# Altium schematic sheet DNJLV1.1.SchDoc
size A2; SheetNumber: 2; SheetTotal: 3
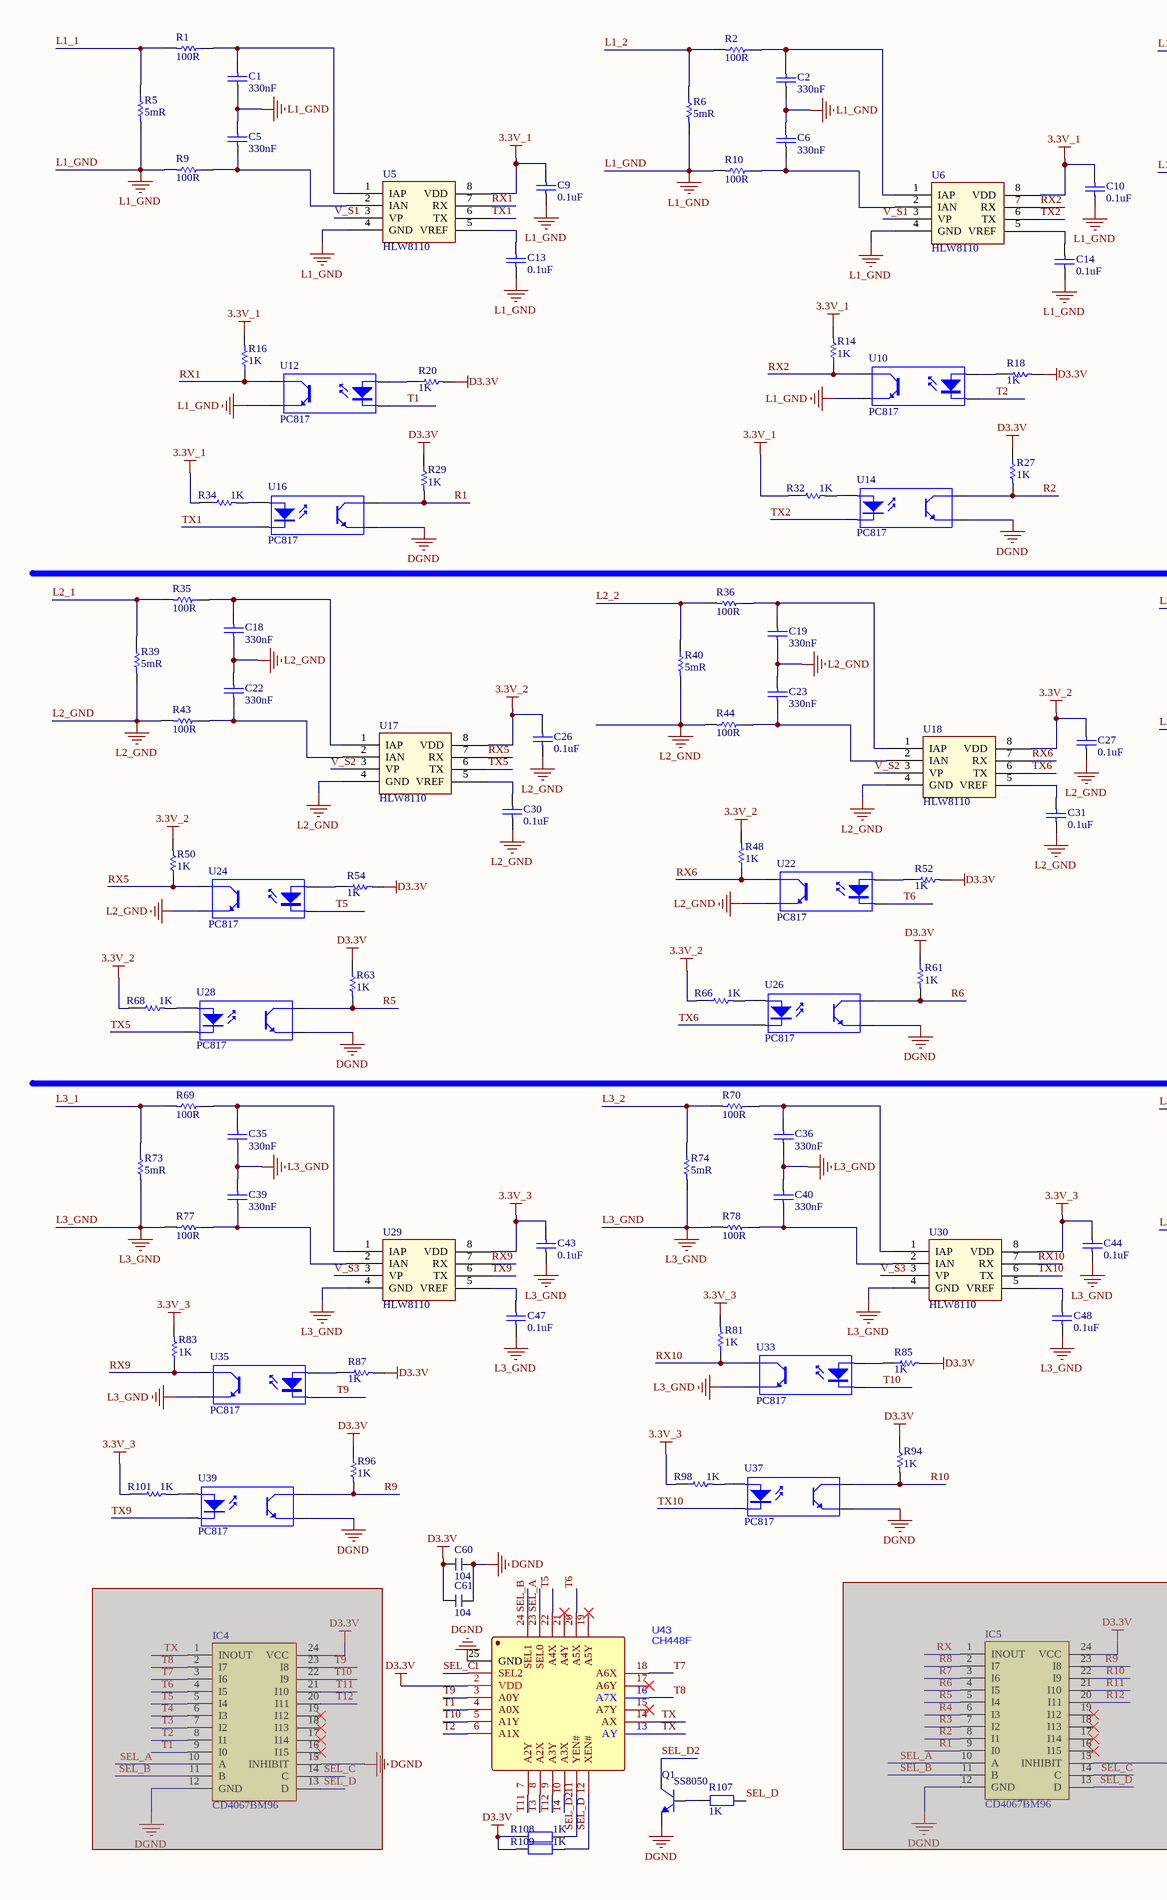
[diagram p0: DNJLV1.1.SchDoc, left]
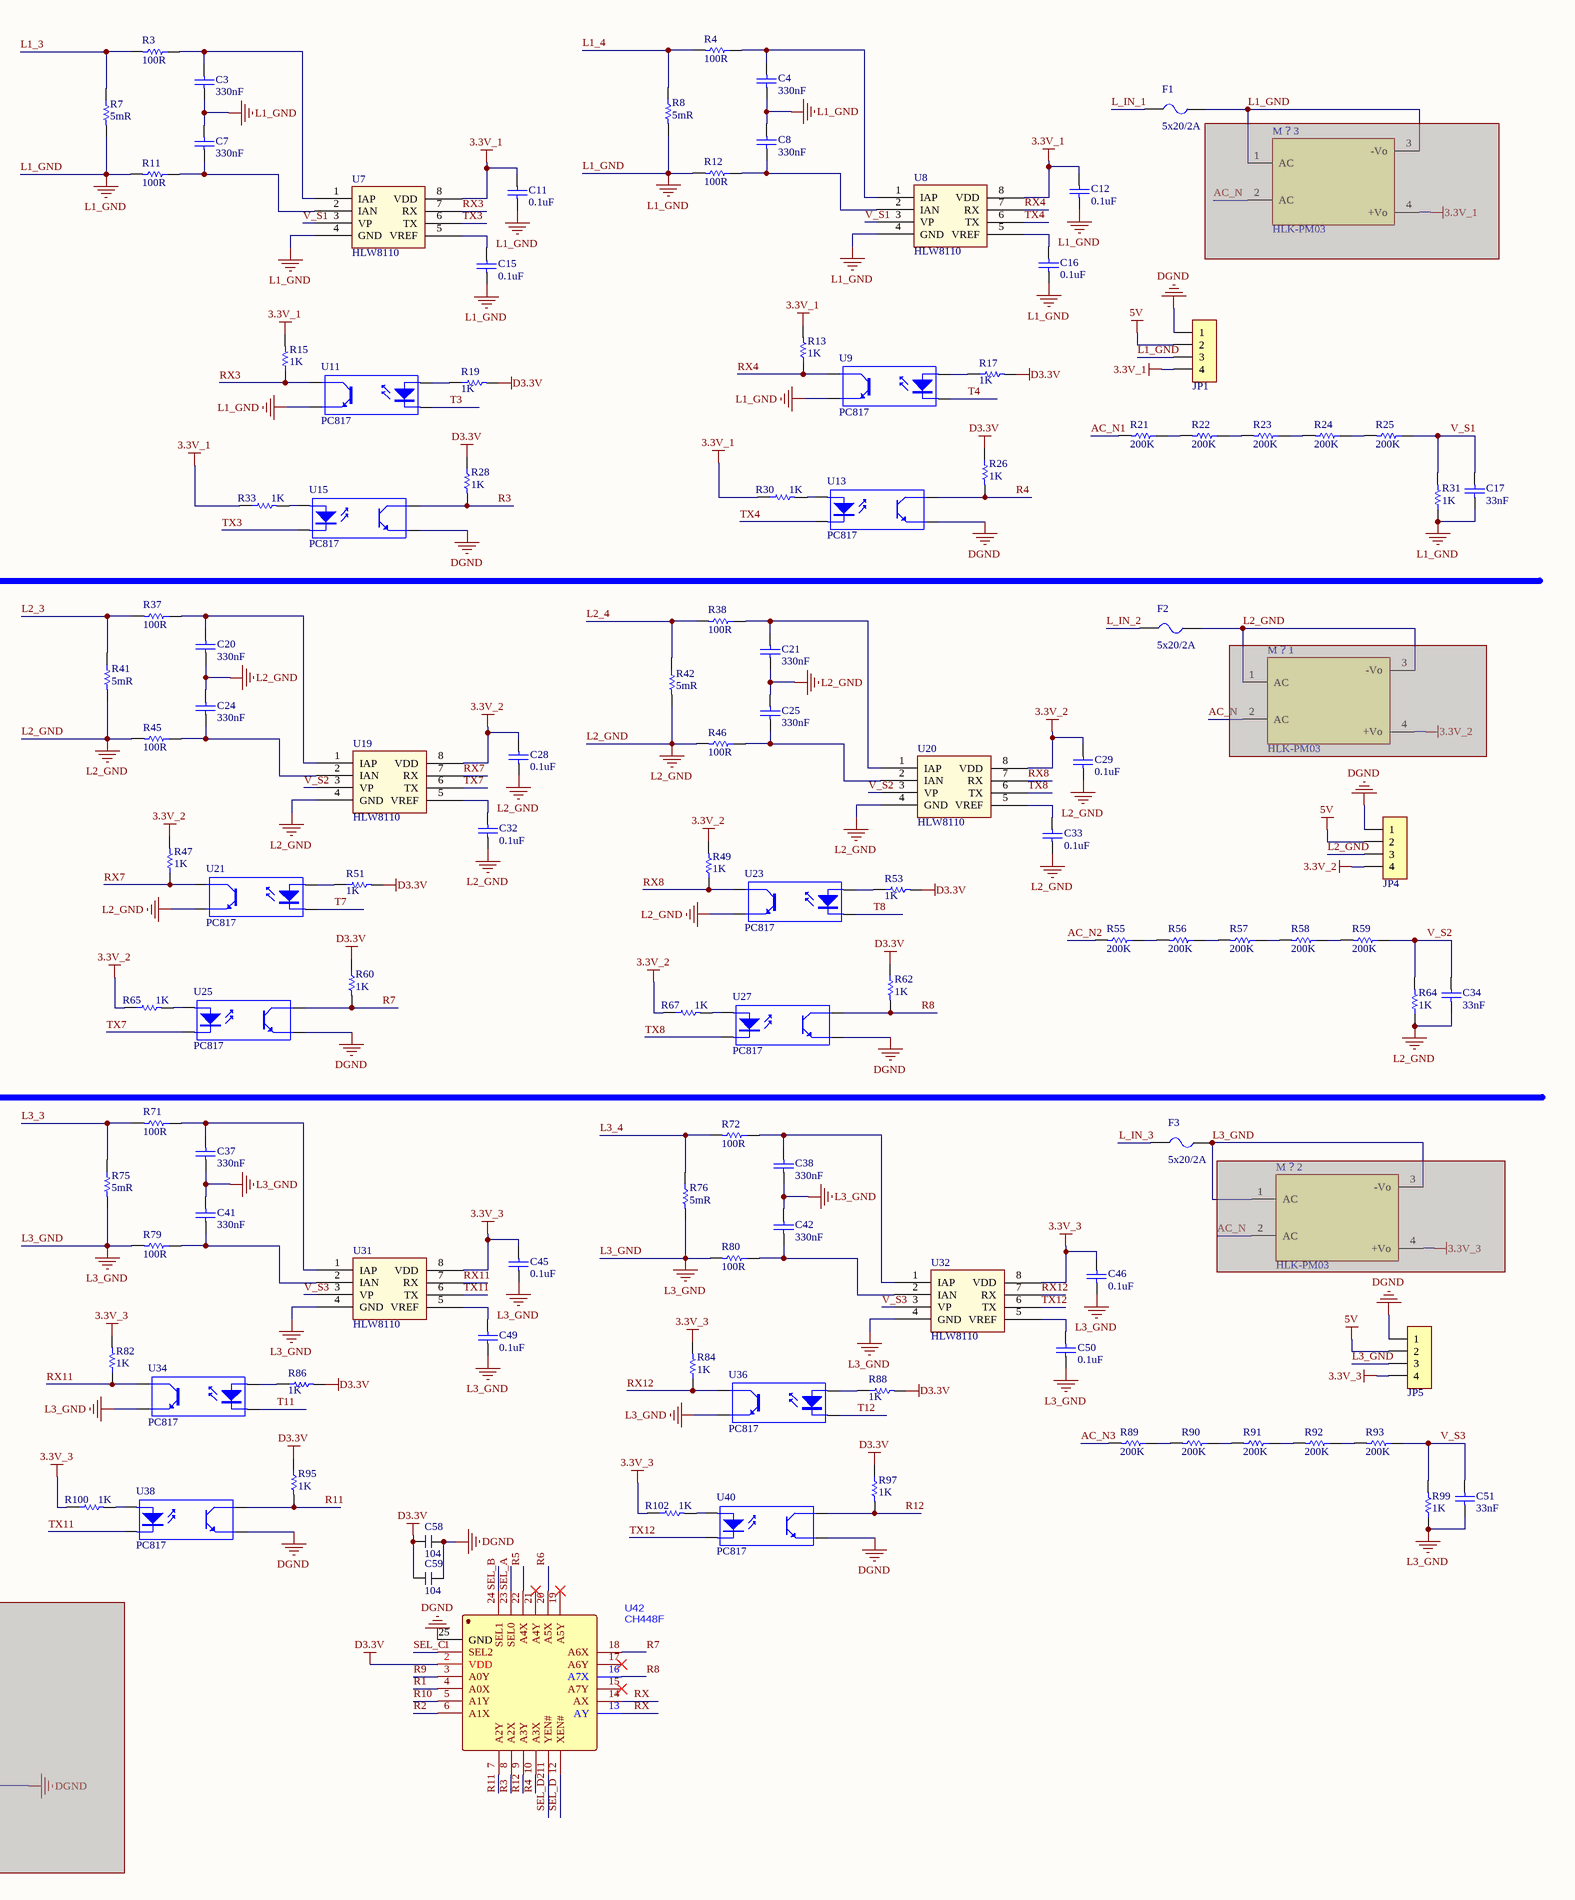
[diagram p1: DNJLV1.1.SchDoc, right]

## Parts
C1  330nF  [C 0805_L]
C2  330nF  [C 0805_L]
C3  330nF  [C 0805_L]
C4  330nF  [C 0805_L]
C5  330nF  [C 0805_L]
C6  330nF  [C 0805_L]
C7  330nF  [C 0805_L]
C8  330nF  [C 0805_L]
C9  0.1uF  [C 0805_L]
C10  0.1uF  [C 0805_L]
C11  0.1uF  [C 0805_L]
C12  0.1uF  [C 0805_L]
C13  0.1uF  [C 0805_L]
C14  0.1uF  [C 0805_L]
C15  0.1uF  [C 0805_L]
C16  0.1uF  [C 0805_L]
C17  33nF  [C 0805_L]
C18  330nF  [C 0805_L]
C19  330nF  [C 0805_L]
C20  330nF  [C 0805_L]
C21  330nF  [C 0805_L]
C22  330nF  [C 0805_L]
C23  330nF  [C 0805_L]
C24  330nF  [C 0805_L]
C25  330nF  [C 0805_L]
C26  0.1uF  [C 0805_L]
C27  0.1uF  [C 0805_L]
C28  0.1uF  [C 0805_L]
C29  0.1uF  [C 0805_L]
C30  0.1uF  [C 0805_L]
C31  0.1uF  [C 0805_L]
C32  0.1uF  [C 0805_L]
C33  0.1uF  [C 0805_L]
C34  33nF  [C 0805_L]
C35  330nF  [C 0805_L]
C36  330nF  [C 0805_L]
C37  330nF  [C 0805_L]
C38  330nF  [C 0805_L]
C39  330nF  [C 0805_L]
C40  330nF  [C 0805_L]
C41  330nF  [C 0805_L]
C42  330nF  [C 0805_L]
C43  0.1uF  [C 0805_L]
C44  0.1uF  [C 0805_L]
C45  0.1uF  [C 0805_L]
C46  0.1uF  [C 0805_L]
C47  0.1uF  [C 0805_L]
C48  0.1uF  [C 0805_L]
C49  0.1uF  [C 0805_L]
C50  0.1uF  [C 0805_L]
C51  33nF  [C 0805_L]
C58  104  [C 0603_L]
C59  104  [C 0603_L]
C60  104  [C 0603_L]
C61  104  [C 0603_L]
F1  5x20/2A  [FU BLX-A]
F2  5x20/2A  [FU BLX-A]
F3  5x20/2A  [FU BLX-A]
IC4  CD4067BM96  [SOP24_M]  (masked out: inside a compile mask, not in the netlist)
IC5  CD4067BM96  [SOP24_M]  (masked out: inside a compile mask, not in the netlist)
JP1  HDR-1X4  [HDR2.54-M-LI-4P]  (value not drawn)
JP4  HDR-1X4  [HDR2.54-M-LI-4P]  (value not drawn)
JP5  HDR-1X4  [HDR2.54-M-LI-4P]  (value not drawn)
M？1  HLK-PM03  [HLINK-PM03]  (masked out: inside a compile mask, not in the netlist)
M？2  HLK-PM03  [HLINK-PM03]  (masked out: inside a compile mask, not in the netlist)
M？3  HLK-PM03  [HLINK-PM03]  (masked out: inside a compile mask, not in the netlist)
Q1  SS8050  [SOT23-3N]
R1  100R  [R 0805_L]
R2  100R  [R 0805_L]
R3  100R  [R 0805_L]
R4  100R  [R 0805_L]
R5  5mR  [R 2512_L]
R6  5mR  [R 2512_L]
R7  5mR  [R 2512_L]
R8  5mR  [R 2512_L]
R9  100R  [R 0805_L]
R10  100R  [R 0805_L]
R11  100R  [R 0805_L]
R12  100R  [R 0805_L]
R13  1K  [R 0805_L]
R14  1K  [R 0805_L]
R15  1K  [R 0805_L]
R16  1K  [R 0805_L]
R17  1K  [R 0805_L]
R18  1K  [R 0805_L]
R19  1K  [R 0805_L]
R20  1K  [R 0805_L]
R21  200K  [R 0805_L]
R22  200K  [R 0805_L]
R23  200K  [R 0805_L]
R24  200K  [R 0805_L]
R25  200K  [R 0805_L]
R26  1K  [R 0805_L]
R27  1K  [R 0805_L]
R28  1K  [R 0805_L]
R29  1K  [R 0805_L]
R30  1K  [R 0805_L]
R31  1K  [R 0805_L]
R32  1K  [R 0805_L]
R33  1K  [R 0805_L]
R34  1K  [R 0805_L]
R35  100R  [R 0805_L]
R36  100R  [R 0805_L]
R37  100R  [R 0805_L]
R38  100R  [R 0805_L]
R39  5mR  [R 2512_L]
R40  5mR  [R 2512_L]
R41  5mR  [R 2512_L]
R42  5mR  [R 2512_L]
R43  100R  [R 0805_L]
R44  100R  [R 0805_L]
R45  100R  [R 0805_L]
R46  100R  [R 0805_L]
R47  1K  [R 0805_L]
R48  1K  [R 0805_L]
R49  1K  [R 0805_L]
R50  1K  [R 0805_L]
R51  1K  [R 0805_L]
R52  1K  [R 0805_L]
R53  1K  [R 0805_L]
R54  1K  [R 0805_L]
R55  200K  [R 0805_L]
R56  200K  [R 0805_L]
R57  200K  [R 0805_L]
R58  200K  [R 0805_L]
R59  200K  [R 0805_L]
R60  1K  [R 0805_L]
R61  1K  [R 0805_L]
R62  1K  [R 0805_L]
R63  1K  [R 0805_L]
R64  1K  [R 0805_L]
R65  1K  [R 0805_L]
R66  1K  [R 0805_L]
R67  1K  [R 0805_L]
R68  1K  [R 0805_L]
R69  100R  [R 0805_L]
R70  100R  [R 0805_L]
R71  100R  [R 0805_L]
R72  100R  [R 0805_L]
R73  5mR  [R 2512_L]
R74  5mR  [R 2512_L]
R75  5mR  [R 2512_L]
R76  5mR  [R 2512_L]
R77  100R  [R 0805_L]
R78  100R  [R 0805_L]
R79  100R  [R 0805_L]
R80  100R  [R 0805_L]
R81  1K  [R 0805_L]
R82  1K  [R 0805_L]
R83  1K  [R 0805_L]
R84  1K  [R 0805_L]
R85  1K  [R 0805_L]
R86  1K  [R 0805_L]
R87  1K  [R 0805_L]
R88  1K  [R 0805_L]
R89  200K  [R 0805_L]
R90  200K  [R 0805_L]
R91  200K  [R 0805_L]
R92  200K  [R 0805_L]
R93  200K  [R 0805_L]
R94  1K  [R 0805_L]
R95  1K  [R 0805_L]
R96  1K  [R 0805_L]
R97  1K  [R 0805_L]
R98  1K  [R 0805_L]
R99  1K  [R 0805_L]
R100  1K  [R 0805_L]
R101  1K  [R 0805_L]
R102  1K  [R 0805_L]
R107  1K  [R 0603_L]
R108  1K  [R 0603_L]
R109  1K  [R 0603_L]
U5  HLW8110  [HM8110]
U6  HLW8110  [HM8110]
U7  HLW8110  [HM8110]
U8  HLW8110  [HM8110]
U9  PC817  [SO-4]
U10  PC817  [SO-4]
U11  PC817  [SO-4]
U12  PC817  [SO-4]
U13  PC817  [SO-4]
U14  PC817  [SO-4]
U15  PC817  [SO-4]
U16  PC817  [SO-4]
U17  HLW8110  [HM8110]
U18  HLW8110  [HM8110]
U19  HLW8110  [HM8110]
U20  HLW8110  [HM8110]
U21  PC817  [SO-4]
U22  PC817  [SO-4]
U23  PC817  [SO-4]
U24  PC817  [SO-4]
U25  PC817  [SO-4]
U26  PC817  [SO-4]
U27  PC817  [SO-4]
U28  PC817  [SO-4]
U29  HLW8110  [HM8110]
U30  HLW8110  [HM8110]
U31  HLW8110  [HM8110]
U32  HLW8110  [HM8110]
U33  PC817  [SO-4]
U34  PC817  [SO-4]
U35  PC817  [SO-4]
U36  PC817  [SO-4]
U37  PC817  [SO-4]
U38  PC817  [SO-4]
U39  PC817  [SO-4]
U40  PC817  [SO-4]
U42  CH448F  [QFN24 4x4_M]
U43  CH448F  [QFN24 4x4_M]

## Nets
3.3V_1: C9.1 C10.1 C11.1 C12.1 JP1.4 R13.2 R14.2 R15.2 R16.2 R30.1 R32.1 R33.1 R34.1 U5.8(VDD) U6.8(VDD) U7.8(VDD) U8.8(VDD)
3.3V_2: C26.1 C27.1 C28.1 C29.1 JP4.4 R47.2 R48.2 R49.2 R50.2 R65.1 R66.1 R67.1 R68.1 U17.8(VDD) U18.8(VDD) U19.8(VDD) U20.8(VDD)
3.3V_3: C43.1 C44.1 C45.1 C46.1 JP5.4 R81.2 R82.2 R83.2 R84.2 R98.1 R100.1 R101.1 R102.1 U29.8(VDD) U30.8(VDD) U31.8(VDD) U32.8(VDD)
5V: JP1.2 JP4.2 JP5.2
D3.3V: C58.1 C59.1 C60.1 C61.1 R17.2 R18.2 R19.2 R20.2 R26.1 R27.1 R28.1 R29.1 R51.2 R52.2 R53.2 R54.2 R60.1 R61.1 R62.1 R63.1 R85.2 R86.2 R87.2 R88.2 R94.1 R95.1 R96.1 R97.1 R108.2 R109.2 U42.2(VDD) U43.2(VDD)
DGND: C58.2 C59.2 C60.2 C61.2 JP1.1 JP4.1 JP5.1 Q1.2(E) U13.3(E) U14.3(E) U15.3(E) U16.3(E) U25.3(E) U26.3(E) U27.3(E) U28.3(E) U37.3(E) U38.3(E) U39.3(E) U40.3(E) U42.25(GND) U43.25(GND)
L1_GND: C1.1 C2.1 C3.1 C4.1 C5.2 C6.2 C7.2 C8.2 C9.2 C10.2 C11.2 C12.2 C13.1 C14.1 C15.1 C16.1 C17.1 F1.1 JP1.3 R5.2 R6.2 R7.2 R8.2 R9.2 R10.2 R11.2 R12.2 R31.1 U5.4(GND) U6.4(GND) U7.4(GND) U8.4(GND) U9.3(E) U10.3(E) U11.3(E) U12.3(E)
L2_GND: C18.1 C19.1 C20.1 C21.1 C22.2 C23.2 C24.2 C25.2 C26.2 C27.2 C28.2 C29.2 C30.1 C31.1 C32.1 C33.1 C34.1 F2.1 JP4.3 R39.2 R40.2 R41.2 R42.2 R43.2 R44.2 R45.2 R46.2 R64.1 U17.4(GND) U18.4(GND) U19.4(GND) U20.4(GND) U21.3(E) U22.3(E) U23.3(E) U24.3(E)
L3_GND: C35.1 C36.1 C37.1 C38.1 C39.2 C40.2 C41.2 C42.2 C43.2 C44.2 C45.2 C46.2 C47.1 C48.1 C49.1 C50.1 C51.1 F3.1 JP5.3 R73.2 R74.2 R75.2 R76.2 R77.2 R78.2 R79.2 R80.2 R99.1 U29.4(GND) U30.4(GND) U31.4(GND) U32.4(GND) U33.3(E) U34.3(E) U35.3(E) U36.3(E)
AC_N1: R21.2
AC_N2: R55.2
AC_N3: R89.2
L1_1: R1.2 R5.1
L1_2: R2.2 R6.1
L1_3: R3.2 R7.1
L1_4: R4.2 R8.1
L2_1: R35.2 R39.1
L2_2: R36.2 R40.1
L2_3: R37.2 R41.1
L2_4: R38.2 R42.1
L3_1: R69.2 R73.1
L3_2: R70.2 R74.1
L3_3: R71.2 R75.1
L3_4: R72.2 R76.1
L_IN_1: F1.2
L_IN_2: F2.2
L_IN_3: F3.2
R1: R29.2 U16.4(C) U42.4(A0X)
R2: R27.2 U14.4(C) U42.6(A1X)
R3: R28.2 U15.4(C) U42.8(A2X)
R4: R26.2 U13.4(C) U42.10(A3X)
R5: R63.2 U28.4(C) U42.22(A4X)
R6: R61.2 U26.4(C) U42.20(A5X)
R7: R60.2 U25.4(C) U42.18(A6X)
R8: R62.2 U27.4(C) U42.16(A7X)
R9: R96.2 U39.4(C) U42.3(A0Y)
R10: R94.2 U37.4(C) U42.5(A1Y)
R11: R95.2 U38.4(C) U42.7(A2Y)
R12: R97.2 U40.4(C) U42.9(A3Y)
RX: U42.13(AY) U42.14(AX)
RX1: R16.1 U5.7(RX) U12.4(C)
RX2: R14.1 U6.7(RX) U10.4(C)
RX3: R15.1 U7.7(RX) U11.4(C)
RX4: R13.1 U8.7(RX) U9.4(C)
RX5: R50.1 U17.7(RX) U24.4(C)
RX6: R48.1 U18.7(RX) U22.4(C)
RX7: R47.1 U19.7(RX) U21.4(C)
RX8: R49.1 U20.7(RX) U23.4(C)
RX9: R83.1 U29.7(RX) U35.4(C)
RX10: R81.1 U30.7(RX) U33.4(C)
RX11: R82.1 U31.7(RX) U34.4(C)
RX12: R84.1 U32.7(RX) U36.4(C)
SEL_A: U42.23(SEL0) U43.23(SEL0)
SEL_B: U42.24(SEL1) U43.24(SEL1)
SEL_C: U42.1(SEL2) U43.1(SEL2)
SEL_D: R107.2 R109.1 U42.12(XEN#) U43.12(XEN#)
SEL_D2: Q1.3(C) R108.1 U42.11(YEN#) U43.11(YEN#)
T1: U12.2(K) U43.4(A0X)
T2: U10.2(K) U43.6(A1X)
T3: U11.2(K) U43.8(A2X)
T4: U9.2(K) U43.10(A3X)
T5: U24.2(K) U43.22(A4X)
T6: U22.2(K) U43.20(A5X)
T7: U21.2(K) U43.18(A6X)
T8: U23.2(K) U43.16(A7X)
T9: U35.2(K) U43.3(A0Y)
T10: U33.2(K) U43.5(A1Y)
T11: U34.2(K) U43.7(A2Y)
T12: U36.2(K) U43.9(A3Y)
TX: U43.13(AY) U43.14(AX)
TX1: U5.6(TX) U16.2(K)
TX2: U6.6(TX) U14.2(K)
TX3: U7.6(TX) U15.2(K)
TX4: U8.6(TX) U13.2(K)
TX5: U17.6(TX) U28.2(K)
TX6: U18.6(TX) U26.2(K)
TX7: U19.6(TX) U25.2(K)
TX8: U20.6(TX) U27.2(K)
TX9: U29.6(TX) U39.2(K)
TX10: U30.6(TX) U37.2(K)
TX11: U31.6(TX) U38.2(K)
TX12: U32.6(TX) U40.2(K)
V_S1: C17.2 R25.1 R31.2 U5.3(VP) U6.3(VP) U7.3(VP) U8.3(VP)
V_S2: C34.2 R59.1 R64.2 U17.3(VP) U18.3(VP) U19.3(VP) U20.3(VP)
V_S3: C51.2 R93.1 R99.2 U29.3(VP) U30.3(VP) U31.3(VP) U32.3(VP)
NetC1_2: C1.2 R1.1 U5.1(IAP)
NetC2_2: C2.2 R2.1 U6.1(IAP)
NetC3_2: C3.2 R3.1 U7.1(IAP)
NetC4_2: C4.2 R4.1 U8.1(IAP)
NetC5_1: C5.1 R9.1 U5.2(IAN)
NetC6_1: C6.1 R10.1 U6.2(IAN)
NetC7_1: C7.1 R11.1 U7.2(IAN)
NetC8_1: C8.1 R12.1 U8.2(IAN)
NetC13_2: C13.2 U5.5(VREF)
NetC14_2: C14.2 U6.5(VREF)
NetC15_2: C15.2 U7.5(VREF)
NetC16_2: C16.2 U8.5(VREF)
NetC18_2: C18.2 R35.1 U17.1(IAP)
NetC19_2: C19.2 R36.1 U18.1(IAP)
NetC20_2: C20.2 R37.1 U19.1(IAP)
NetC21_2: C21.2 R38.1 U20.1(IAP)
NetC22_1: C22.1 R43.1 U17.2(IAN)
NetC23_1: C23.1 R44.1 U18.2(IAN)
NetC24_1: C24.1 R45.1 U19.2(IAN)
NetC25_1: C25.1 R46.1 U20.2(IAN)
NetC30_2: C30.2 U17.5(VREF)
NetC31_2: C31.2 U18.5(VREF)
NetC32_2: C32.2 U19.5(VREF)
NetC33_2: C33.2 U20.5(VREF)
NetC35_2: C35.2 R69.1 U29.1(IAP)
NetC36_2: C36.2 R70.1 U30.1(IAP)
NetC37_2: C37.2 R71.1 U31.1(IAP)
NetC38_2: C38.2 R72.1 U32.1(IAP)
NetC39_1: C39.1 R77.1 U29.2(IAN)
NetC40_1: C40.1 R78.1 U30.2(IAN)
NetC41_1: C41.1 R79.1 U31.2(IAN)
NetC42_1: C42.1 R80.1 U32.2(IAN)
NetC47_2: C47.2 U29.5(VREF)
NetC48_2: C48.2 U30.5(VREF)
NetC49_2: C49.2 U31.5(VREF)
NetC50_2: C50.2 U32.5(VREF)
NetQ1_1: Q1.1(B) R107.1
NetR17_1: R17.1 U9.1(A)
NetR18_1: R18.1 U10.1(A)
NetR19_1: R19.1 U11.1(A)
NetR20_1: R20.1 U12.1(A)
NetR21_1: R21.1 R22.2
NetR22_1: R22.1 R23.2
NetR23_1: R23.1 R24.2
NetR24_1: R24.1 R25.2
NetR30_2: R30.2 U13.1(A)
NetR32_2: R32.2 U14.1(A)
NetR33_2: R33.2 U15.1(A)
NetR34_2: R34.2 U16.1(A)
NetR51_1: R51.1 U21.1(A)
NetR52_1: R52.1 U22.1(A)
NetR53_1: R53.1 U23.1(A)
NetR54_1: R54.1 U24.1(A)
NetR55_1: R55.1 R56.2
NetR56_1: R56.1 R57.2
NetR57_1: R57.1 R58.2
NetR58_1: R58.1 R59.2
NetR65_2: R65.2 U25.1(A)
NetR66_2: R66.2 U26.1(A)
NetR67_2: R67.2 U27.1(A)
NetR68_2: R68.2 U28.1(A)
NetR85_1: R85.1 U33.1(A)
NetR86_1: R86.1 U34.1(A)
NetR87_1: R87.1 U35.1(A)
NetR88_1: R88.1 U36.1(A)
NetR89_1: R89.1 R90.2
NetR90_1: R90.1 R91.2
NetR91_1: R91.1 R92.2
NetR92_1: R92.1 R93.2
NetR98_2: R98.2 U37.1(A)
NetR100_2: R100.2 U38.1(A)
NetR101_2: R101.2 U39.1(A)
NetR102_2: R102.2 U40.1(A)

Not connected (* = marked no-connect by the designer): U42 15(A7Y)* 17(A6Y)* 19(A5Y)* 21(A4Y)*; U43 15(A7Y)* 17(A6Y)* 19(A5Y)* 21(A4Y)*

## Library data of the parts
C1-C51 = Cap: Capacitor; Published: 8-Jun-2000; LatestRevisionDate: 17-Jul-2002; LatestRevisionNote: Re-released for DXP Platform.; PackageReference: RAD-0.3; Publisher: Altium Limited
  C1-C8 C18-C25 C35-C42: Value: 330nF
  C9-C16 C26-C33 C43-C50: Value: 0.1uF
  C17 C34 C51: Value: 33nF
C58-C61 = C: 贴片电容; BOM名称: 无极性贴片电容; 淘宝ID: 封装库来自淘宝 ID：黄晶宝石; 联系售后，技术支持: https://shop463601444.taobao.com; 唯一出售店铺网址: https://shop463601444.taobao.com
F1-F3 = FU 5x20: 5*20保险丝; 版权归属: 源创客; BOM名称: 5*20保险丝; 学习资源: www.ooocke.com
IC4 IC5 = CD4067BM96: 16通道模拟开关
JP1 JP4 JP5 = Header 4: 4P接插件; 版权归属: 封装库来自淘宝 ID：黄晶宝石; BOM名称: 4P接插件; 学习资源: https://shop463601444.taobao.com
M？1-M？3 = Component_1: HI-LINK AC-DC3.3V电源模块
Q1 = 8050-SMD: 高频放大-NPN型; 版权归属: 封装库来自淘宝 ID：黄晶宝石; 属性: 40V 1.5A 1W 100MHZ; BOM名称: 高频放大-NPN型; 联系售后: https://shop463601444.taobao.com
R1-R12 R21-R25 R31 R35-R46 R55-R59 R64 R69-R80 R89-R93 R99 = Res: Resistor; Published: 8-Jun-2000; LatestRevisionDate: 17-Jul-2002; LatestRevisionNote: Re-released for DXP Platform.; PackageReference: AXIAL-0.3; Publisher: Altium Limited
  R1-R4 R9-R12 R35-R38 R43-R46 R69-R72 R77-R80: Value: 100R
  R5-R8 R39-R42 R73-R76: Value: 5mR
  R21-R25 R55-R59 R89-R93: Value: 200K
  R31 R64 R99: Value: 1K
R13-R20 R26-R30 R32-R34 R47-R54 R60-R63 R65-R68 R81-R88 R94-R98 R100-R102 = Res1: Resistor; Published: 8-Jun-2000; LatestRevisionDate: 17-Jul-2002; LatestRevisionNote: Re-released for DXP Platform.; Publisher: Altium Limited
R107-R109 = R: 贴片电阻; 版权归属: 来自淘宝 ID：黄晶宝石; 封装库来自淘宝卖家 ID：黄晶宝石: 其他店铺购入均为盗版，不享受售后技术支持服务，请立即申请退款; BOM名称: 贴片电阻; 联系售后: https://shop463601444.taobao.com
U9-U16 U21-U28 U33-U40 = Optoisolator1: 4-Pin Phototransistor Optocoupler; Published: 24-Mar-1999; LatestRevisionDate: 04-Mar-2005; LatestRevisionNote: Sch pins 3 & 4 Swapped.; DatasheetVersion: Nov-2003; PackageReference: DIP-4; Publisher: Altium Limited